# Altium schematic sheet main.SchDoc: Main
size A4; Date: 2012-11-01; Author: Artur Scholz; DocumentNumber: LibreCube LC41-02a
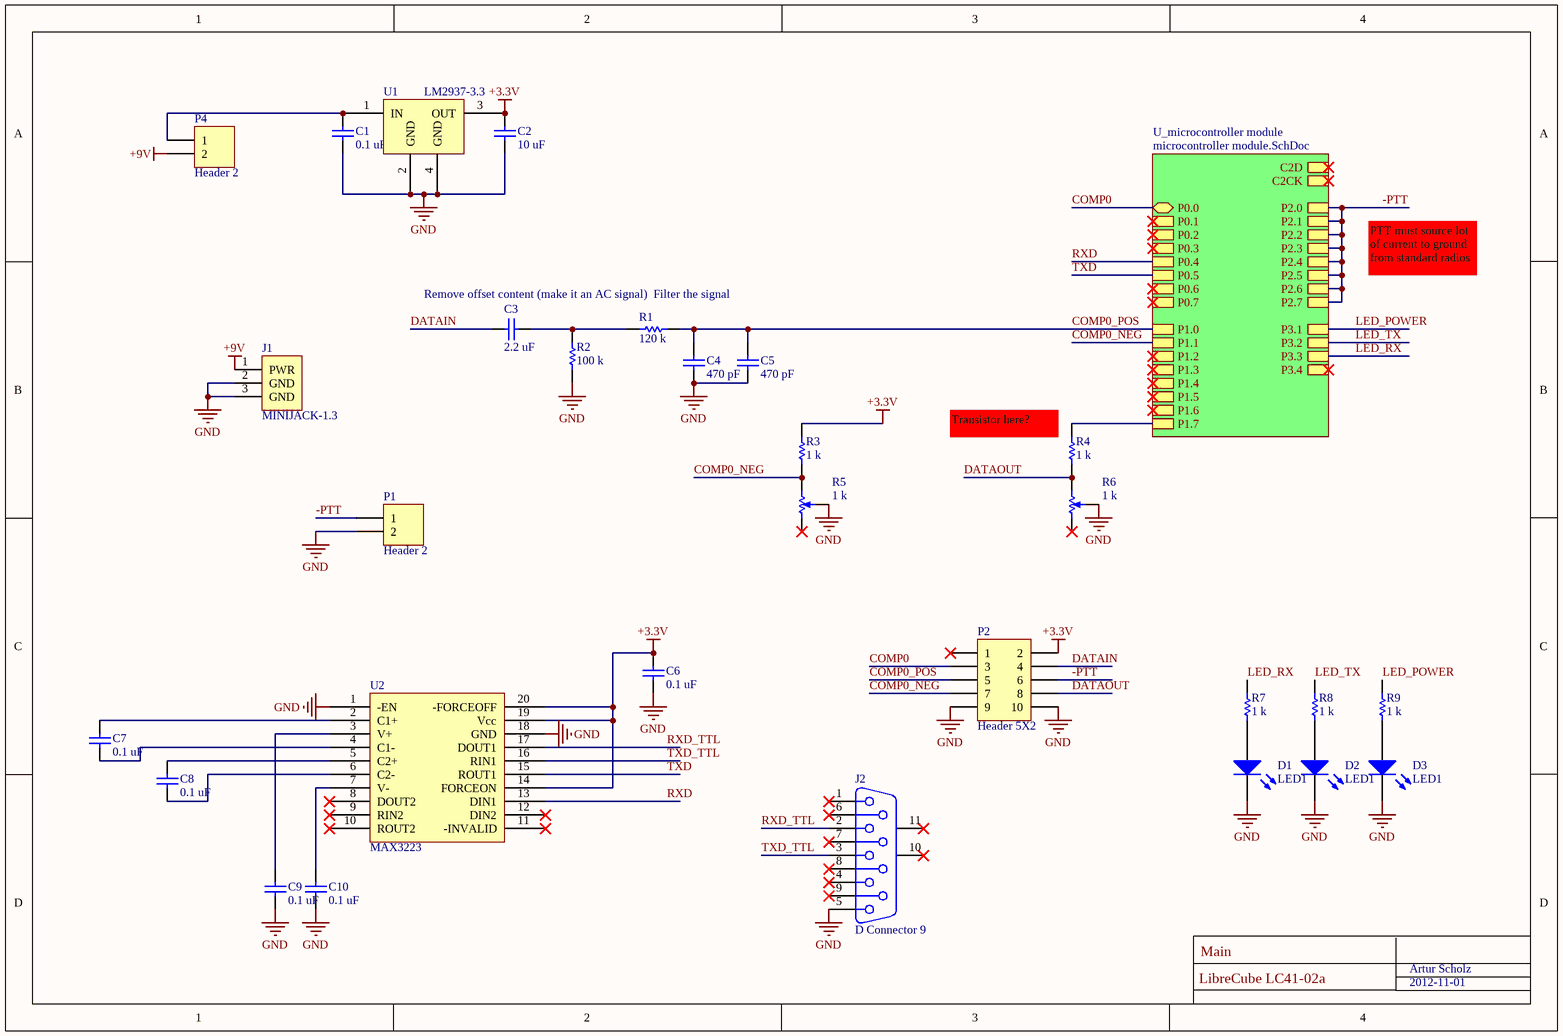
[diagram p0: main.SchDoc]

## Parts
C1  0.1 uF  [0603]
C2  10 uF  [1206]
C3  2.2 uF  [0603]
C4  470 pF  [0603]
C5  470 pF  [0603]
C6  0.1 uF  [0603]
C7  0.1 uF  [0603]
C8  0.1 uF  [0603]
C9  0.1 uF  [0603]
C10  0.1 uF  [0603]
D1  LED1  [LED-1]
D2  LED1  [LED-1]
D3  LED1  [LED-1]
J1  MINIJACK-1.3  [POWERJACK]
J2  D Connector 9  [DSUB1.385-2H9]
P1  Header 2  [HDR1X2]
P2  Header 5X2  [HDR2X5]
P4  Header 2  [HDR1X2]
R1  120 k  [0603]
R2  100 k  [0603]
R3  1 k  [0603]
R4  1 k  [0603]
R5  1 k  [POT4MM-2]
R6  1 k  [POT4MM-2]
R7  1 k  [0603]
R8  1 k  [0603]
R9  1 k  [0603]
U1  LM2937-3.3  [SOT-223]
U2  MAX3223  [TSSOP-20]

## Sub-sheets
U_microcontroller module = microcontroller module.SchDoc: P0.1, P0.2, P0.3, P0.4, P0.5, P0.6, P0.7, P1.0, P1.1, P1.2, P1.3, P1.4, P1.5, P1.6, P1.7, P2.0, P2.1, P3.3, P3.4, P2.7, P2.6, P2.5, P2.4, P2.3, P2.2, P3.2, P3.1, C2D, C2CK, P0.0

## Nets
+3.3V: C2.2 C6.2 P2.2 R3.2 U1.3(OUT) U2.14(FORCEON) U2.19(Vcc) U2.20(-FORCEOFF)
+9V: J1.1(PWR) P4.2
GND: C1.1 C2.1 C4.1 C5.1 C6.1 C9.2 C10.1 D1.2(K) D2.2(K) D3.2(K) J1.2(GND) J1.3(GND) J2.5 P1.2 P2.9 P2.10 R2.1 R5.W R6.W U1.2(GND) U1.4(GND) U2.1(-EN) U2.18(GND)
-PTT: P1.1 P2.6 ; sheet U_microcontroller module/P2.0, sheet U_microcontroller module/P2.1, sheet U_microcontroller module/P2.7, sheet U_microcontroller module/P2.6, sheet U_microcontroller module/P2.5, sheet U_microcontroller module/P2.4, sheet U_microcontroller module/P2.3, sheet U_microcontroller module/P2.2
COMP0: P2.3 ; sheet U_microcontroller module/P0.0
COMP0_NEG: P2.7 R3.1 R5.CW(+) ; sheet U_microcontroller module/P1.1
COMP0_POS: C4.2 C5.2 P2.5 R1.1 ; sheet U_microcontroller module/P1.0
DATAIN: C3.1 P2.4
DATAOUT: P2.8 R4.1 R6.CW(+)
LED_POWER: R9.2 ; sheet U_microcontroller module/P3.1
LED_RX: R7.2 ; sheet U_microcontroller module/P3.3
LED_TX: R8.2 ; sheet U_microcontroller module/P3.2
RXD: U2.13(DIN1) ; sheet U_microcontroller module/P0.4
RXD_TTL: J2.2 U2.17(DOUT1)
TXD: U2.15(ROUT1) ; sheet U_microcontroller module/P0.5
TXD_TTL: J2.3 U2.16(RIN1)
NetC1_2: C1.2 P4.1 U1.1(IN)
NetC3_2: C3.2 R1.2 R2.2
NetC7_1: C7.1 U2.2(C1+)
NetC7_2: C7.2 U2.4(C1-)
NetC8_1: C8.1 U2.6(C2-)
NetC8_2: C8.2 U2.5(C2+)
NetC9_1: C9.1 U2.3(V+)
NetC10_2: C10.2 U2.7(V-)
NetD1_1: D1.1(A) R7.1
NetD2_1: D2.1(A) R8.1
NetD3_1: D3.1(A) R9.1
NetR4_2: R4.2 ; sheet U_microcontroller module/P1.7

Not connected (* = marked no-connect by the designer): J2 1* 4* 6* 7* 8* 9* 10(MH1)* 11(MH2)*; P2 1*; R5 CCW(-)*; R6 CCW(-)*; U2 8(DOUT2)* 9(RIN2)* 10(ROUT2)* 11(-INVALID)* 12(DIN2)*

## Notes on the sheet
- Remove offset content (make it an AC signal)
- (near R1) Filter the signal
- PTT must source lot of current to ground from standard radios
- (near R4) Transistor here?

## Library data of the parts
C1-C10 = Capacitor
D1-D3 = LED1: Typical RED GaAs LED; Published: 8-Jun-2000; LatestRevisionDate: 08-Jul-2005; LatestRevisionNote: Mech Layer 1 removed.; PackageReference: LED-1; Publisher: Altium Limited
J1 = PWRJACK-1.3
J2 = D Connector 9: Receptacle Assembly, 9 Position, Right Angle; PackageDocument: O; Positions: 9; Published: 15-Jun-2001; LatestRevisionDate: 17-Jul-2002; LatestRevisionNote: Re-released for DXP Platform.; DatasheetDocument: 1-Sep-1999; PackageReference: 788750; Publisher: Altium Limited; Orientation: Right Angle; Gender: Receptacle
P1 P4 = Header 2: Header, 2-Pin; LatestRevisionDate: 17-Jul-2002; LatestRevisionNote: Re-released for DXP Platform.; Publisher: Altium Limited
P2 = Header 5X2: Header, 5-Pin, Dual row; LatestRevisionDate: 17-Jul-2002; LatestRevisionNote: Re-released for DXP Platform.; Publisher: Altium Limited
R1-R4 R7-R9 = Resistor
R5 R6 = RPot SM: Square Trimming Potentiometer; Published: 17-Dec-2003; DatasheetVersion: Oct-2003; PackageReference: POT4MM-2; Publisher: Altium Limited; ComponentLink1Description: Manufacturer Link; ComponentLink1URL: http://bourns.com/2/search.html
U1 = LM2937: LDO